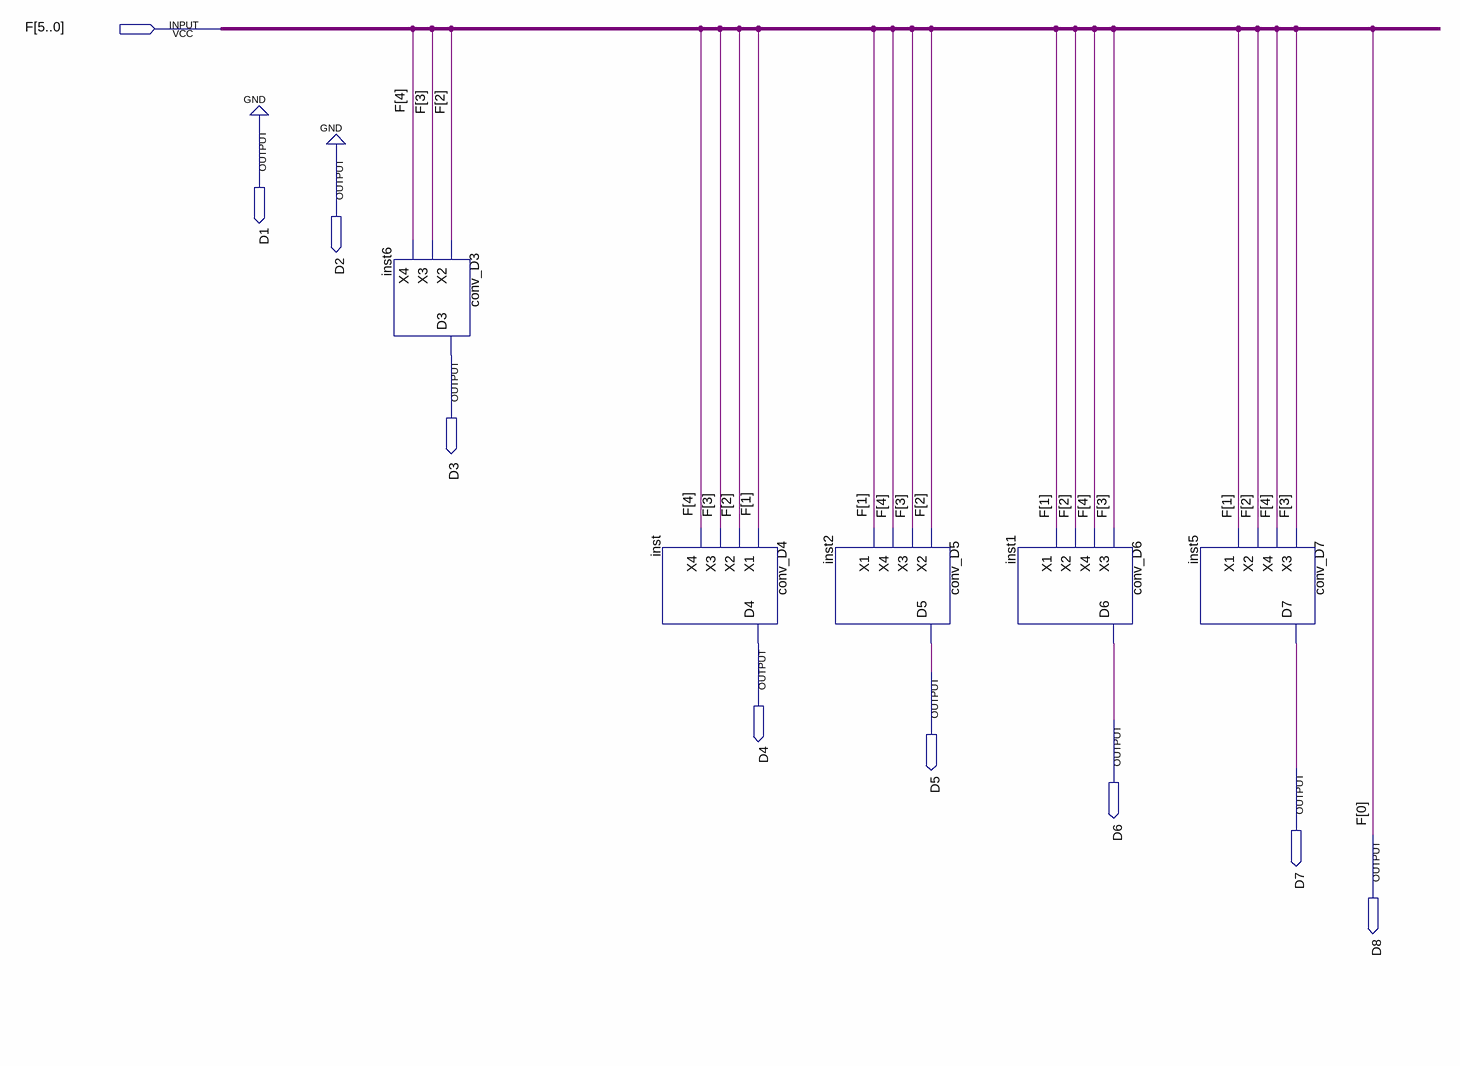
[diagram p0: schematic sheet]
// Quartus schematic conv_2_digitos.bdf as structural Verilog: 5 symbols, 9 pins
module conv_2_digitos (
  input  [5:0] F,
  output D1,
  output D2,
  output D3,
  output D4,
  output D5,
  output D6,
  output D7,
  output D8
);

  conv_D3 inst6 (.X2(F[2]), .X3(F[3]), .X4(F[4]), .D3(D3));
  conv_D4 inst (.X1(F[1]), .X2(F[2]), .X3(F[3]), .X4(F[4]), .D4(D4));
  conv_D5 inst2 (.X2(F[2]), .X3(F[3]), .X4(F[4]), .X1(F[1]), .D5(D5));
  conv_D6 inst1 (.X3(F[3]), .X4(F[4]), .X2(F[2]), .X1(F[1]), .D6(D6));
  conv_D7 inst5 (.X3(F[3]), .X4(F[4]), .X2(F[2]), .X1(F[1]), .D7(D7));

  assign D1 = 1'b0;
  assign D2 = 1'b0;
  assign D8 = F[0];
endmodule
